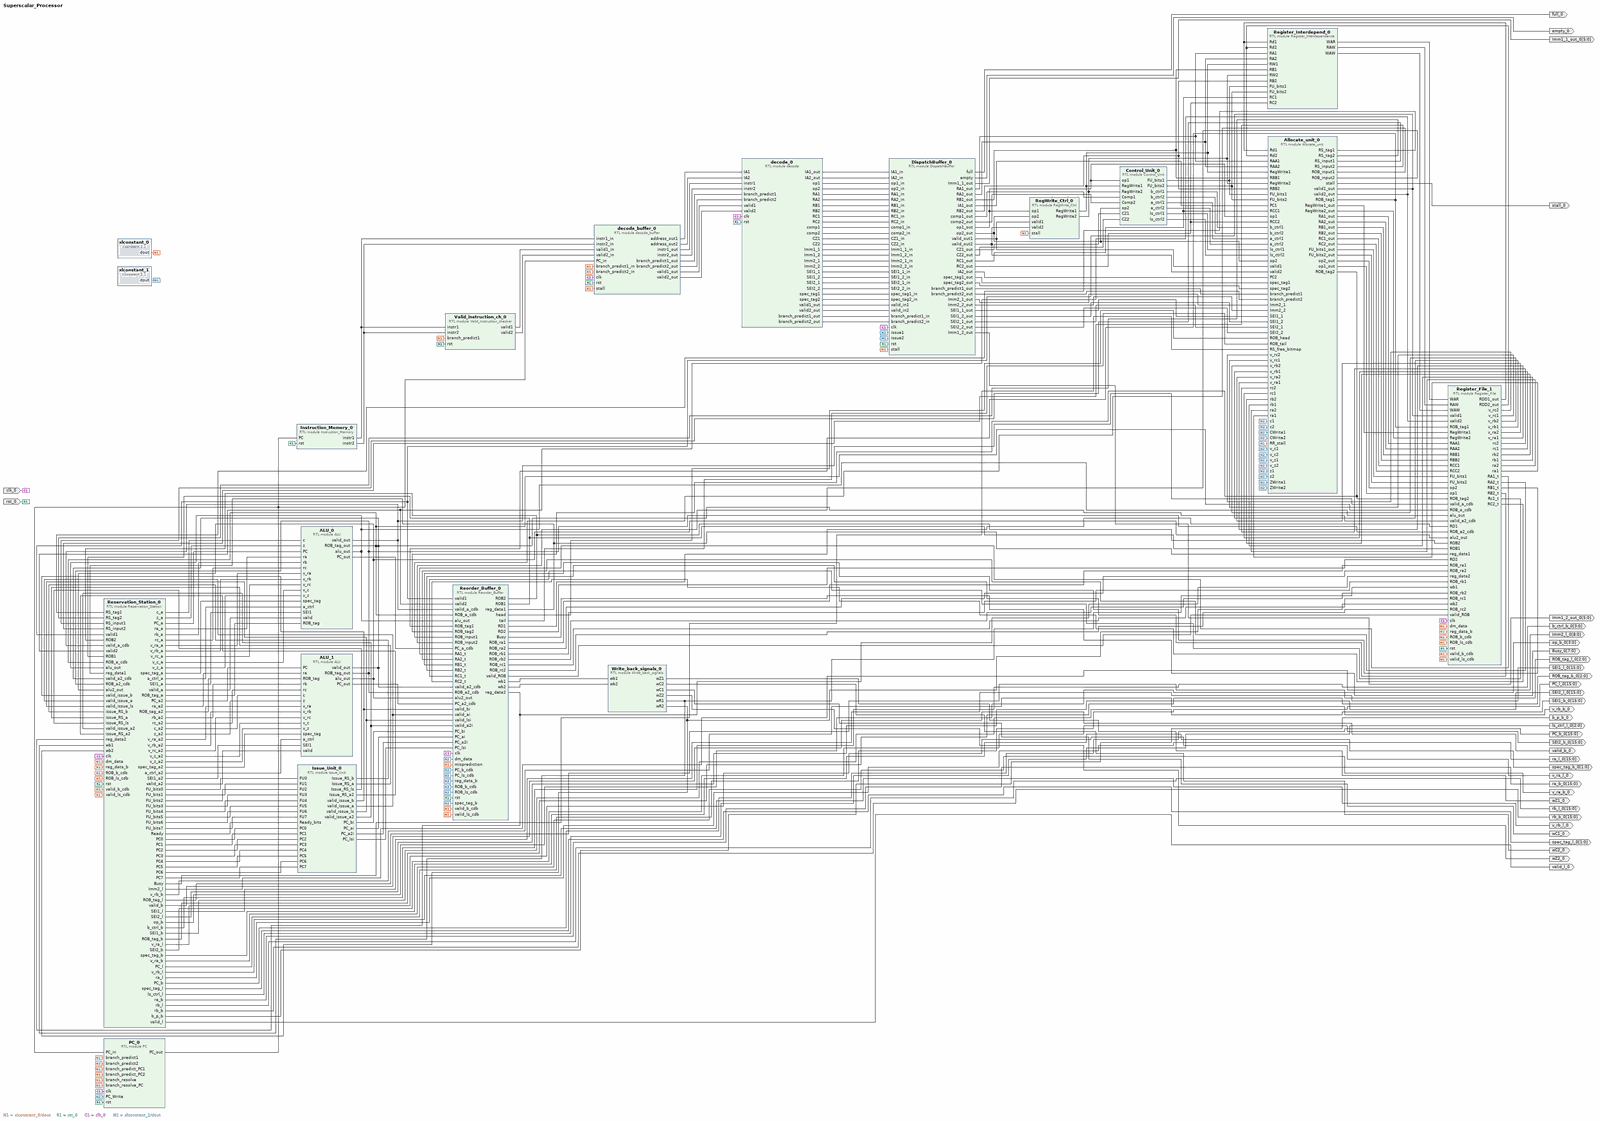
[diagram p0: block diagram of the top level, whole]
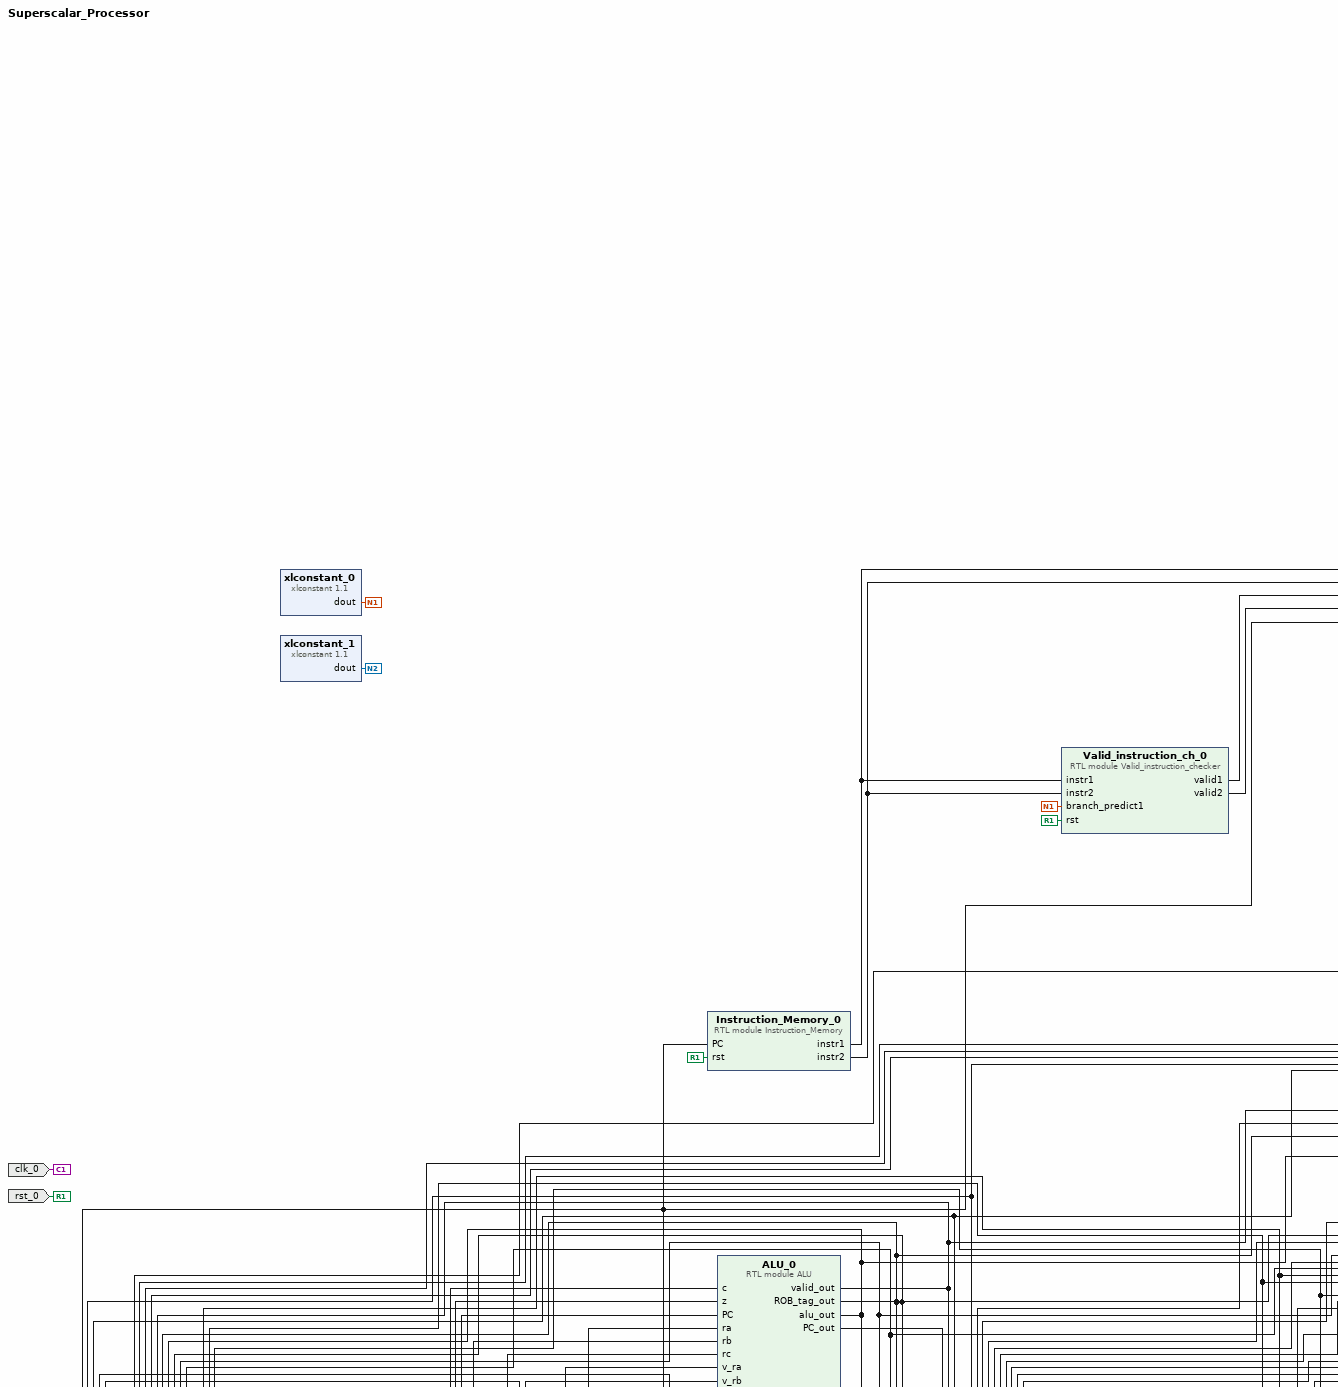
[diagram p1: block diagram of the top level, upper left part]
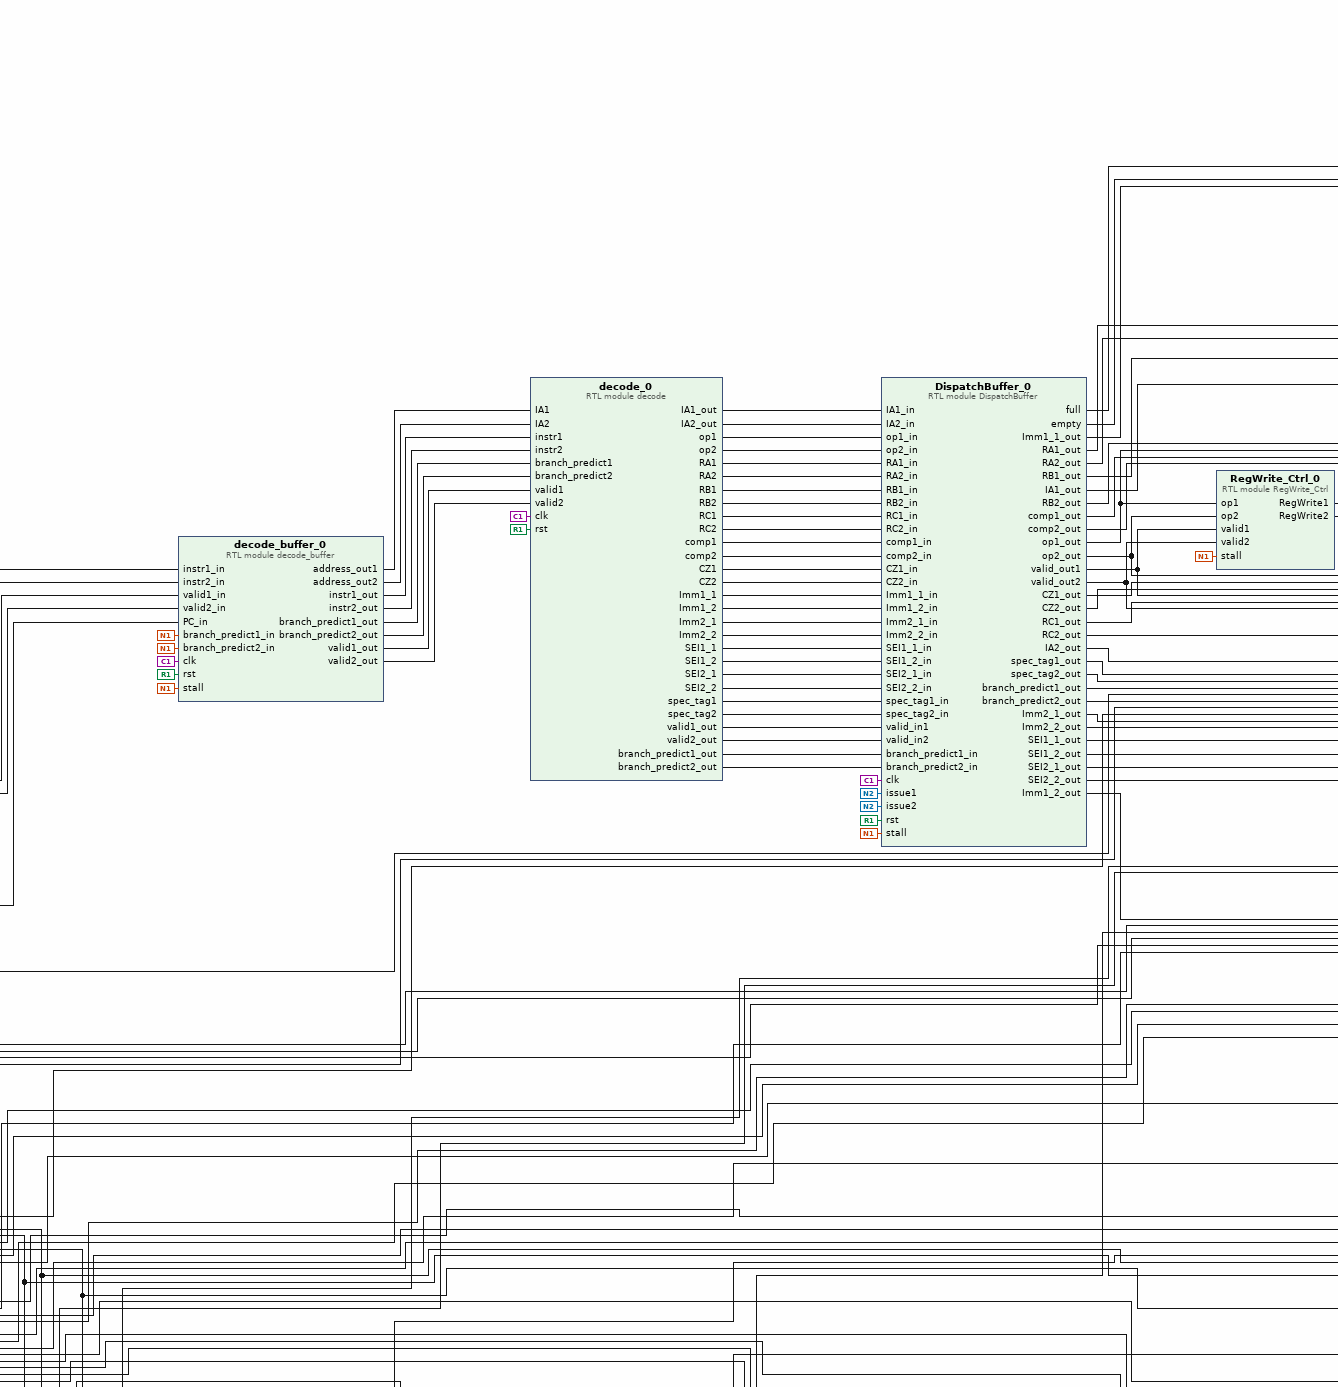
[diagram p2: block diagram of the top level, upper centre part]
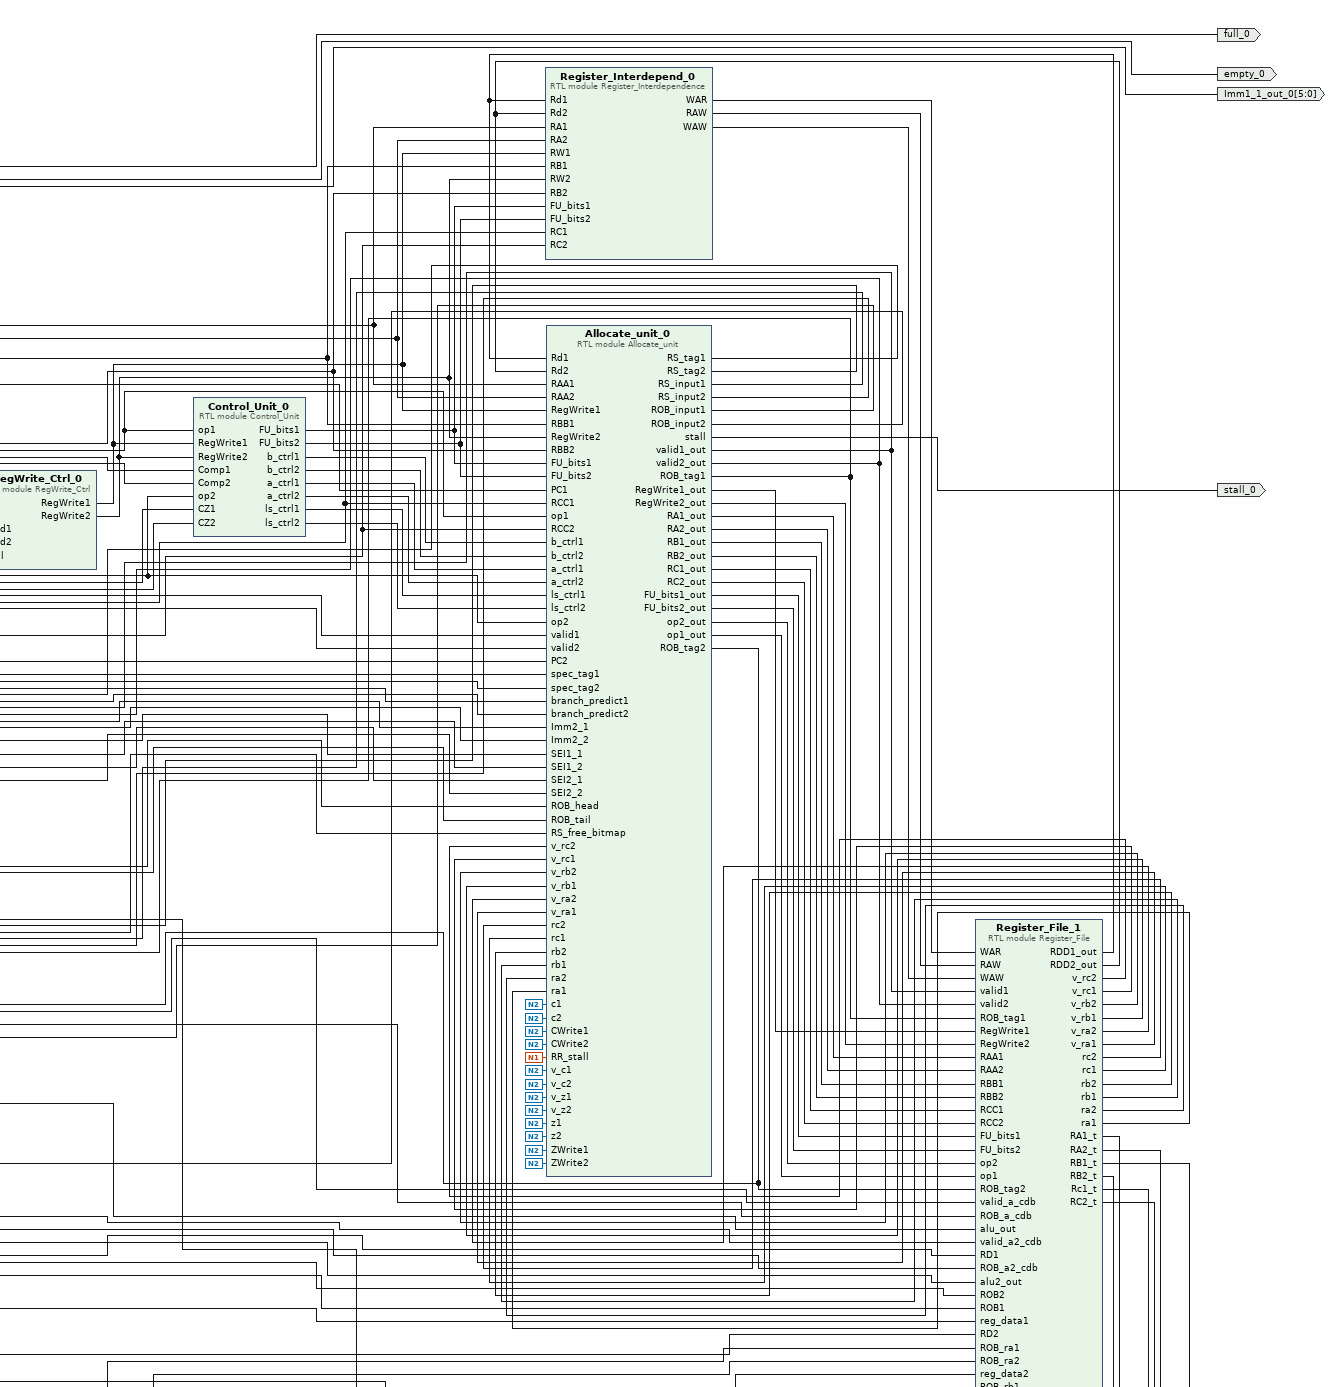
[diagram p3: block diagram of the top level, upper right part]
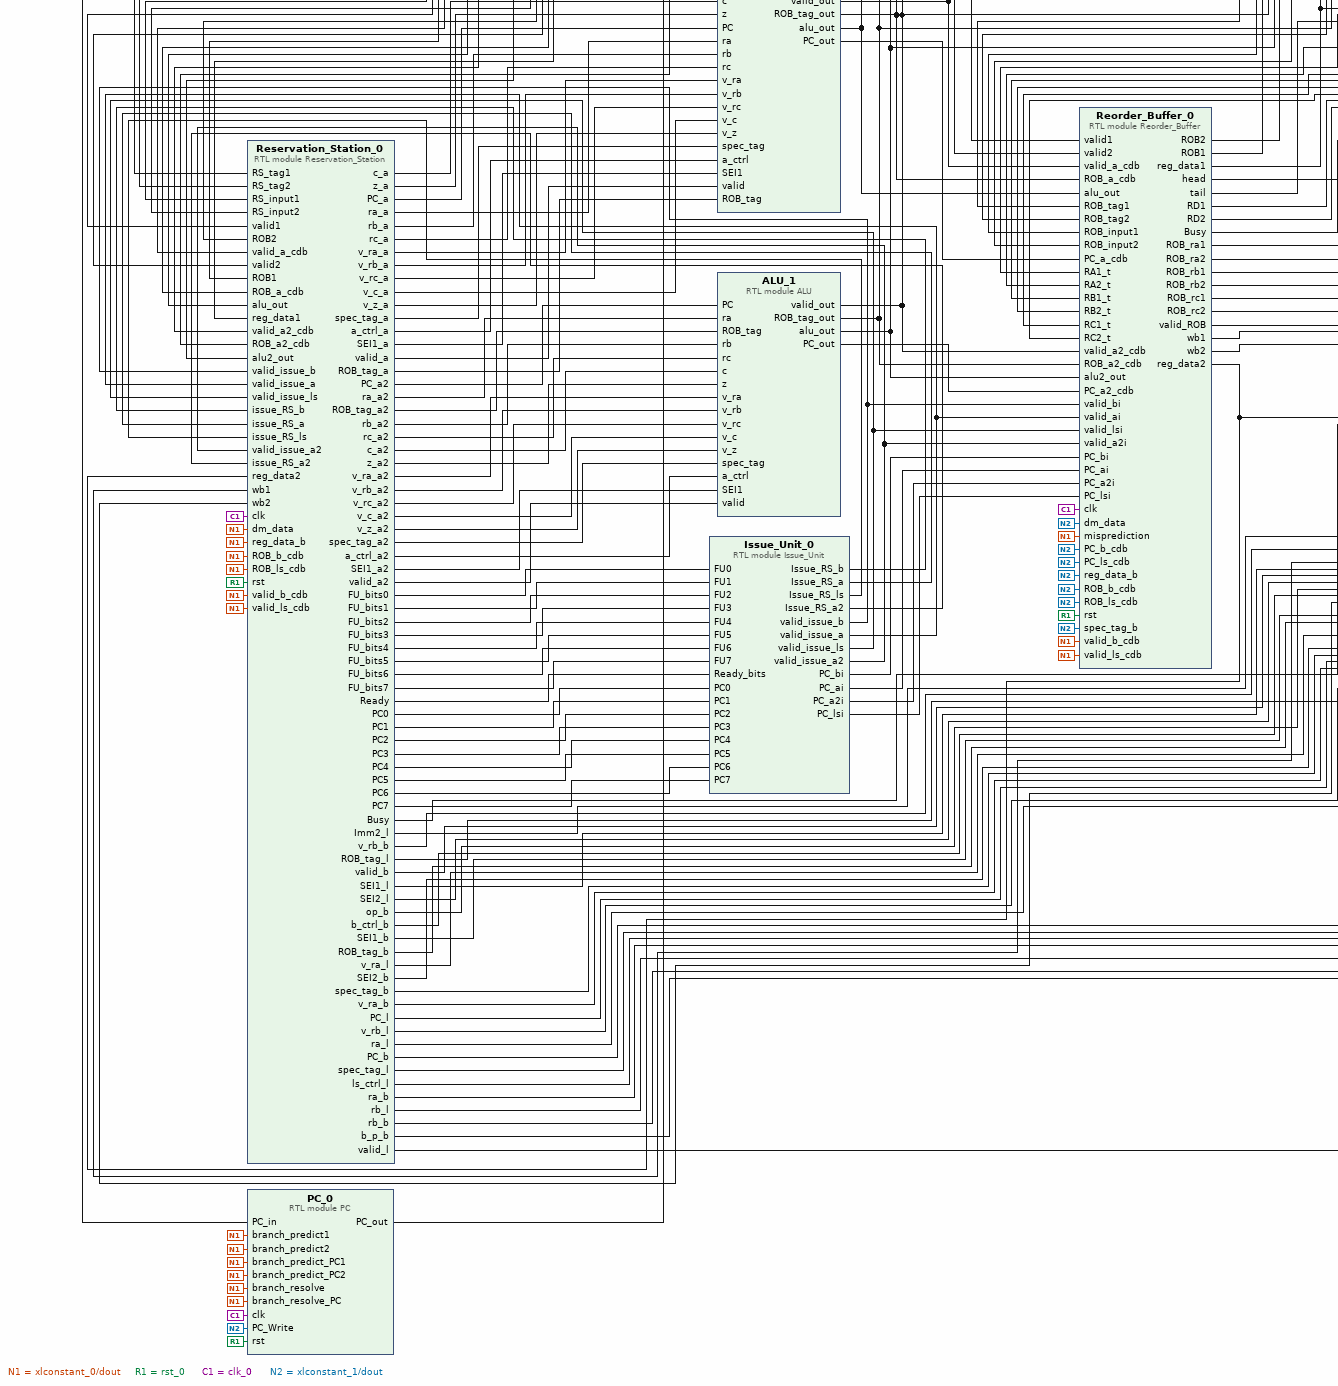
[diagram p4: block diagram of the top level, lower left part]
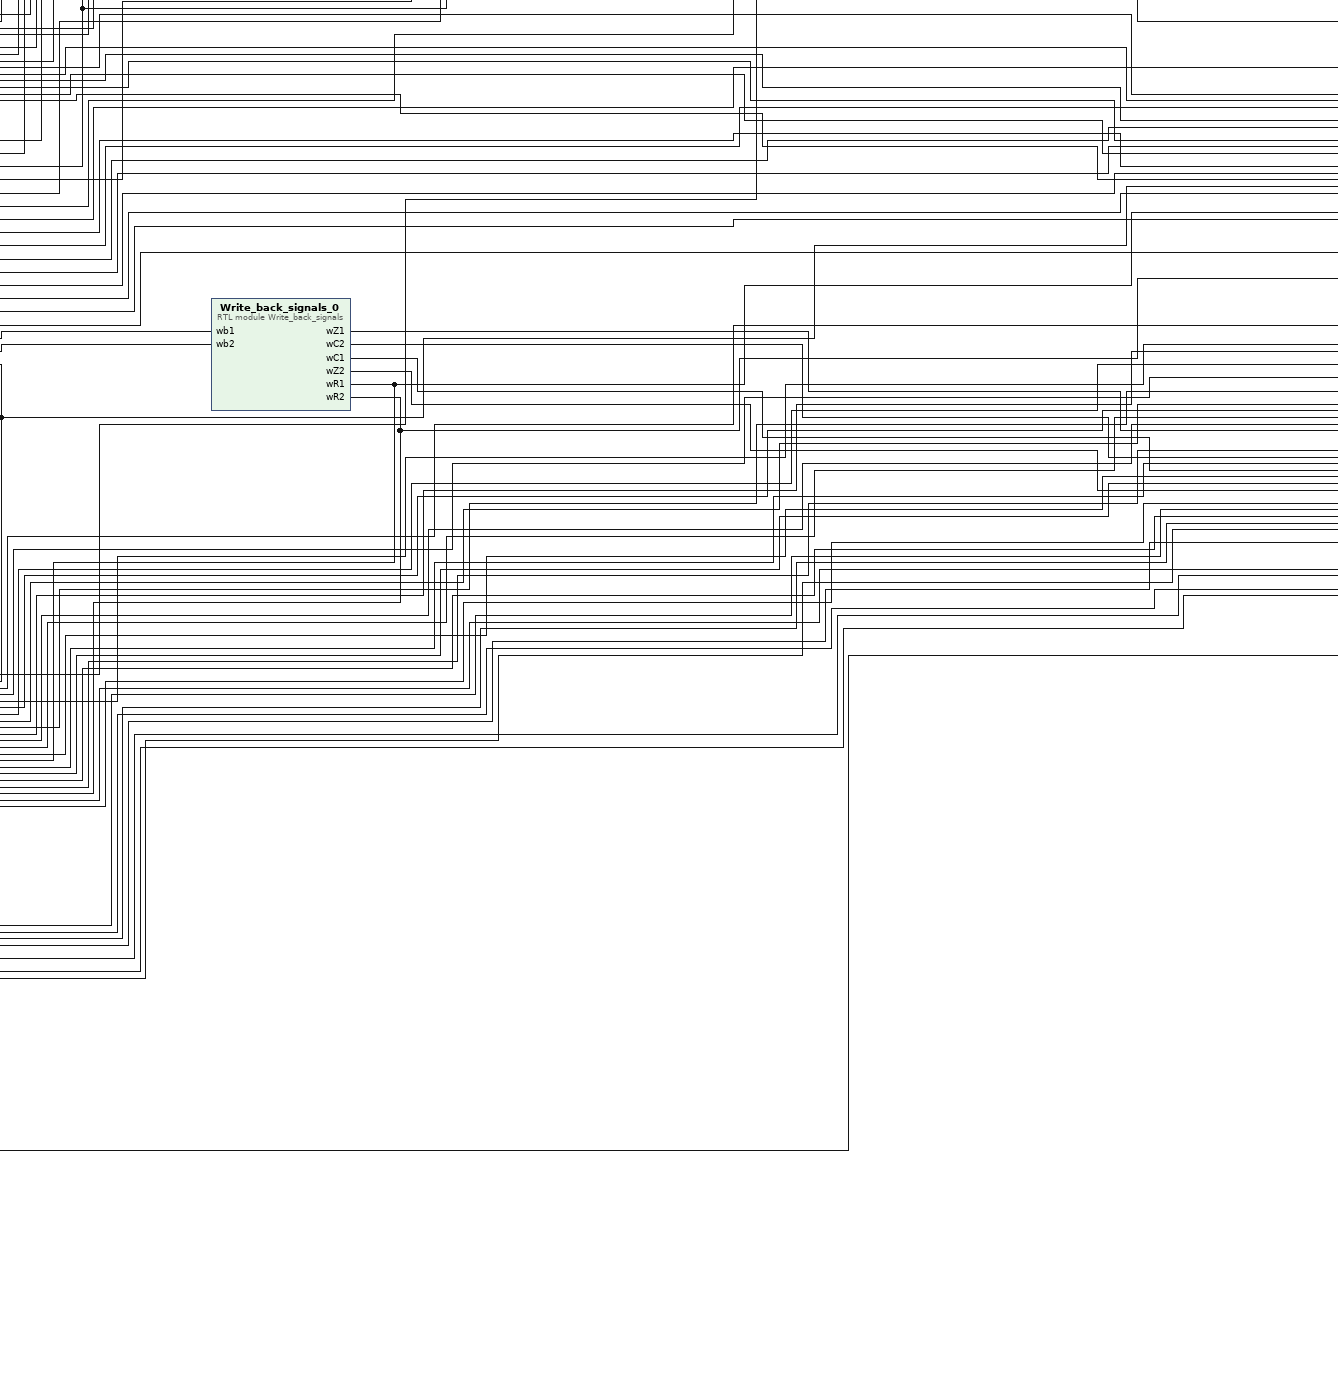
[diagram p5: block diagram of the top level, lower centre part]
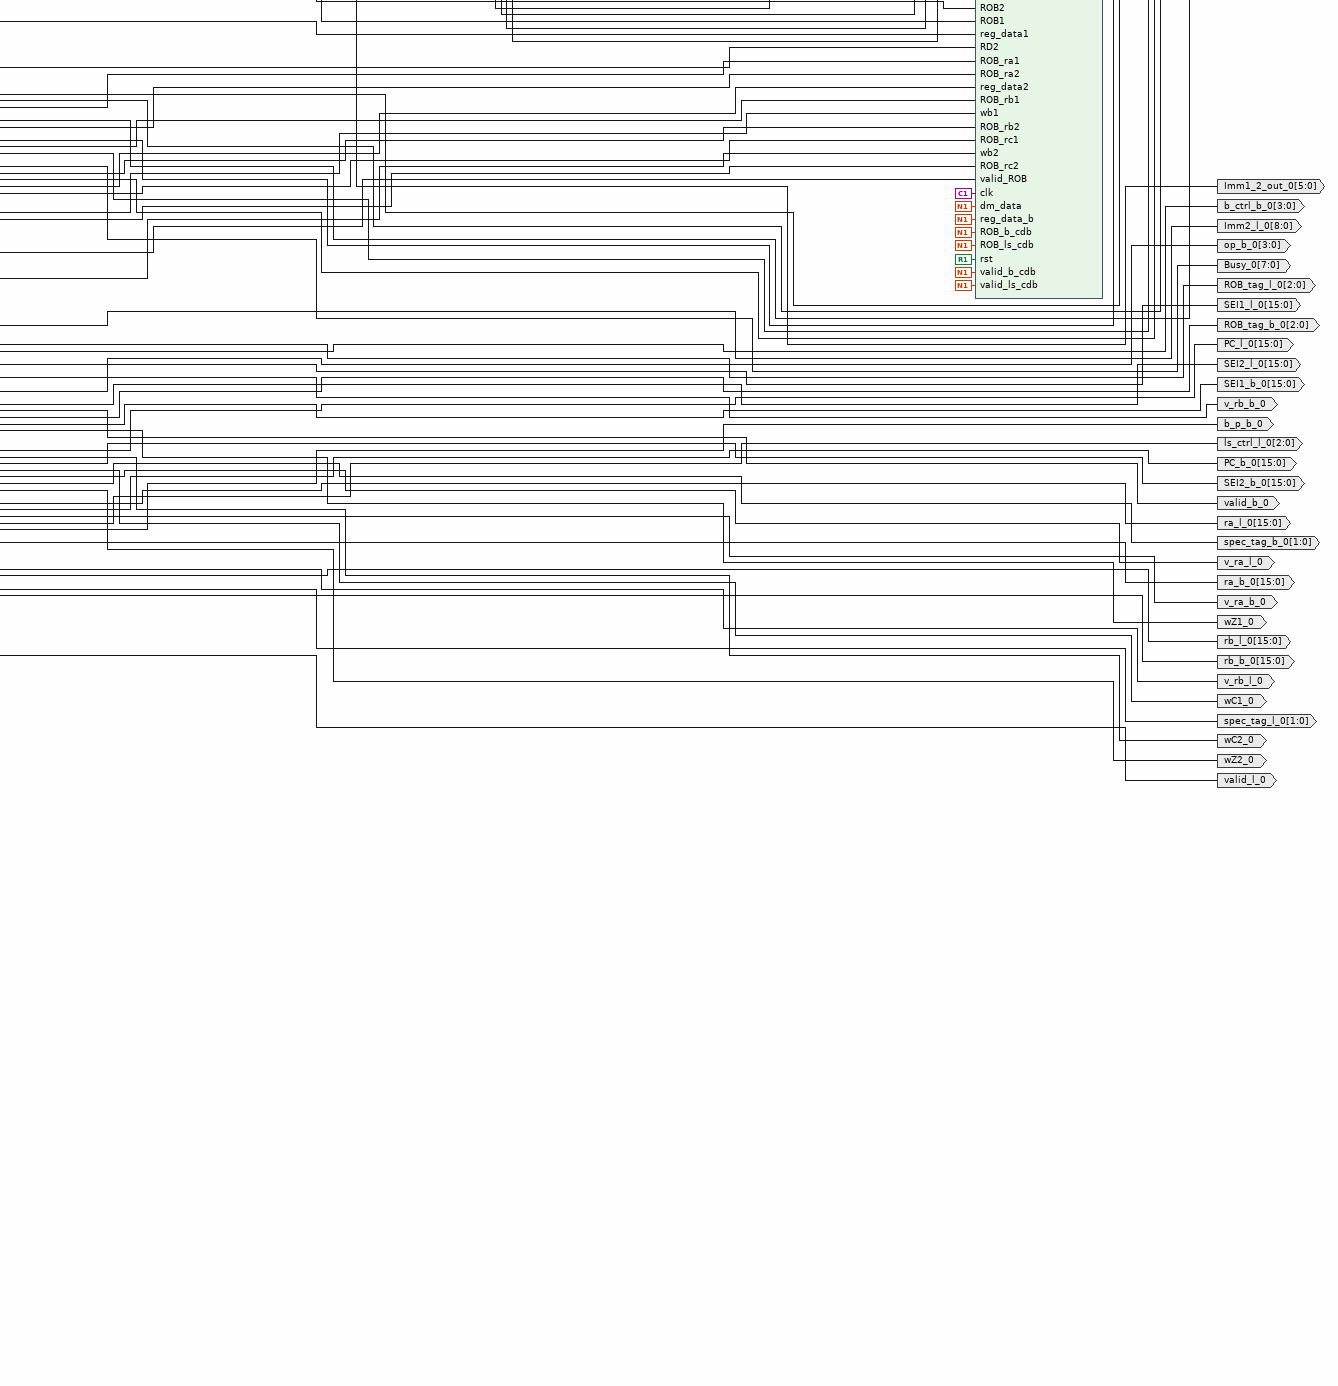
[diagram p6: block diagram of the top level, lower right part]
# Vivado block design Superscalar_Processor, xc7k70tfbv676-1, Vivado 2019.1
create_bd_design Superscalar_Processor

create_bd_port -dir I -type rst rst_0
create_bd_port -dir I -type clk clk_0
create_bd_port -dir O full_0
create_bd_port -dir O empty_0
create_bd_port -dir O -from 5 -to 0 Imm1_1_out_0
create_bd_port -dir O -from 5 -to 0 Imm1_2_out_0
create_bd_port -dir O stall_0
create_bd_port -dir O -from 8 -to 0 Imm2_l_0
create_bd_port -dir O v_rb_b_0
create_bd_port -dir O -from 2 -to 0 ROB_tag_l_0
create_bd_port -dir O valid_b_0
create_bd_port -dir O -from 15 -to 0 SEI1_l_0
create_bd_port -dir O -from 15 -to 0 SEI2_l_0
create_bd_port -dir O -from 3 -to 0 op_b_0
create_bd_port -dir O -from 3 -to 0 b_ctrl_b_0
create_bd_port -dir O -from 15 -to 0 SEI1_b_0
create_bd_port -dir O -from 2 -to 0 ROB_tag_b_0
create_bd_port -dir O v_ra_l_0
create_bd_port -dir O -from 15 -to 0 SEI2_b_0
create_bd_port -dir O -from 1 -to 0 spec_tag_b_0
create_bd_port -dir O v_ra_b_0
create_bd_port -dir O -from 15 -to 0 PC_l_0
create_bd_port -dir O v_rb_l_0
create_bd_port -dir O -from 15 -to 0 ra_l_0
create_bd_port -dir O -from 15 -to 0 PC_b_0
create_bd_port -dir O -from 1 -to 0 spec_tag_l_0
create_bd_port -dir O -from 2 -to 0 ls_ctrl_l_0
create_bd_port -dir O -from 15 -to 0 ra_b_0
create_bd_port -dir O -from 15 -to 0 rb_l_0
create_bd_port -dir O -from 15 -to 0 rb_b_0
create_bd_port -dir O b_p_b_0
create_bd_port -dir O valid_l_0
create_bd_port -dir O -from 7 -to 0 Busy_0
create_bd_port -dir O wZ1_0
create_bd_port -dir O wC2_0
create_bd_port -dir O wC1_0
create_bd_port -dir O wZ2_0

create_bd_cell -type ip -vlnv xilinx.com:ip:xlconstant:1.1 xlconstant_0
set_property -dict {CONFIG.CONST_VAL 0} [get_bd_cells xlconstant_0]
create_bd_cell -type ip -vlnv xilinx.com:ip:xlconstant:1.1 xlconstant_1
create_bd_cell -type module -reference PC PC_0
create_bd_cell -type module -reference RegWrite_Ctrl RegWrite_Ctrl_0
create_bd_cell -type module -reference Write_back_signals Write_back_signals_0
create_bd_cell -type module -reference decode decode_0
create_bd_cell -type module -reference Instruction_Memory Instruction_Memory_0
create_bd_cell -type module -reference Control_Unit Control_Unit_0
create_bd_cell -type module -reference Issue_Unit Issue_Unit_0
create_bd_cell -type module -reference Valid_instruction_checker Valid_instruction_ch_0
create_bd_cell -type module -reference decode_buffer decode_buffer_0
create_bd_cell -type module -reference DispatchBuffer DispatchBuffer_0
create_bd_cell -type module -reference ALU ALU_0
create_bd_cell -type module -reference ALU ALU_1
create_bd_cell -type module -reference Register_Interdependence Register_Interdepend_0
create_bd_cell -type module -reference Reservation_Station Reservation_Station_0
create_bd_cell -type module -reference Register_File Register_File_1
create_bd_cell -type module -reference Reorder_Buffer Reorder_Buffer_0
create_bd_cell -type module -reference Allocate_unit Allocate_unit_0

# ---- connections ----

connect_bd_net [get_bd_pins PC_0/PC_out] [get_bd_pins PC_0/PC_in] [get_bd_pins Instruction_Memory_0/PC] [get_bd_pins decode_buffer_0/PC_in]
connect_bd_net [get_bd_pins Instruction_Memory_0/instr1] [get_bd_pins Valid_instruction_ch_0/instr1] [get_bd_pins decode_buffer_0/instr1_in]
connect_bd_net [get_bd_pins Instruction_Memory_0/instr2] [get_bd_pins Valid_instruction_ch_0/instr2] [get_bd_pins decode_buffer_0/instr2_in]
connect_bd_net [get_bd_pins Valid_instruction_ch_0/valid1] [get_bd_pins decode_buffer_0/valid1_in]
connect_bd_net [get_bd_pins Valid_instruction_ch_0/valid2] [get_bd_pins decode_buffer_0/valid2_in]
connect_bd_net [get_bd_pins xlconstant_0/dout] \
  [get_bd_pins PC_0/branch_predict1] [get_bd_pins PC_0/branch_predict_PC1] [get_bd_pins PC_0/branch_predict2] \
  [get_bd_pins PC_0/branch_predict_PC2] [get_bd_pins PC_0/branch_resolve] [get_bd_pins PC_0/branch_resolve_PC] \
  [get_bd_pins RegWrite_Ctrl_0/stall] [get_bd_pins Valid_instruction_ch_0/branch_predict1] \
  [get_bd_pins decode_buffer_0/stall] [get_bd_pins decode_buffer_0/branch_predict1_in] \
  [get_bd_pins decode_buffer_0/branch_predict2_in] [get_bd_pins DispatchBuffer_0/stall] \
  [get_bd_pins Reservation_Station_0/valid_b_cdb] [get_bd_pins Reservation_Station_0/valid_ls_cdb] \
  [get_bd_pins Reservation_Station_0/reg_data_b] [get_bd_pins Reservation_Station_0/dm_data] \
  [get_bd_pins Reservation_Station_0/ROB_b_cdb] [get_bd_pins Reservation_Station_0/ROB_ls_cdb] \
  [get_bd_pins Register_File_1/valid_b_cdb] [get_bd_pins Register_File_1/valid_ls_cdb] \
  [get_bd_pins Register_File_1/reg_data_b] [get_bd_pins Register_File_1/dm_data] [get_bd_pins Register_File_1/ROB_b_cdb] \
  [get_bd_pins Register_File_1/ROB_ls_cdb] [get_bd_pins Reorder_Buffer_0/valid_b_cdb] \
  [get_bd_pins Reorder_Buffer_0/valid_ls_cdb] [get_bd_pins Reorder_Buffer_0/misprediction] \
  [get_bd_pins Allocate_unit_0/RR_stall]
connect_bd_net [get_bd_pins decode_buffer_0/address_out1] [get_bd_pins decode_0/IA1]
connect_bd_net [get_bd_pins decode_buffer_0/address_out2] [get_bd_pins decode_0/IA2]
connect_bd_net [get_bd_pins decode_buffer_0/instr1_out] [get_bd_pins decode_0/instr1]
connect_bd_net [get_bd_pins decode_buffer_0/instr2_out] [get_bd_pins decode_0/instr2]
connect_bd_net [get_bd_pins decode_buffer_0/branch_predict1_out] [get_bd_pins decode_0/branch_predict1]
connect_bd_net [get_bd_pins decode_buffer_0/branch_predict2_out] [get_bd_pins decode_0/branch_predict2]
connect_bd_net [get_bd_pins decode_buffer_0/valid1_out] [get_bd_pins decode_0/valid1]
connect_bd_net [get_bd_pins decode_buffer_0/valid2_out] [get_bd_pins decode_0/valid2]
connect_bd_net [get_bd_pins decode_0/IA1_out] [get_bd_pins DispatchBuffer_0/IA1_in]
connect_bd_net [get_bd_pins decode_0/IA2_out] [get_bd_pins DispatchBuffer_0/IA2_in]
connect_bd_net [get_bd_pins decode_0/op1] [get_bd_pins DispatchBuffer_0/op1_in]
connect_bd_net [get_bd_pins decode_0/op2] [get_bd_pins DispatchBuffer_0/op2_in]
connect_bd_net [get_bd_pins decode_0/RA1] [get_bd_pins DispatchBuffer_0/RA1_in]
connect_bd_net [get_bd_pins decode_0/RA2] [get_bd_pins DispatchBuffer_0/RA2_in]
connect_bd_net [get_bd_pins decode_0/RB1] [get_bd_pins DispatchBuffer_0/RB1_in]
connect_bd_net [get_bd_pins decode_0/RB2] [get_bd_pins DispatchBuffer_0/RB2_in]
connect_bd_net [get_bd_pins decode_0/RC1] [get_bd_pins DispatchBuffer_0/RC1_in]
connect_bd_net [get_bd_pins decode_0/RC2] [get_bd_pins DispatchBuffer_0/RC2_in]
connect_bd_net [get_bd_pins decode_0/comp1] [get_bd_pins DispatchBuffer_0/comp1_in]
connect_bd_net [get_bd_pins decode_0/comp2] [get_bd_pins DispatchBuffer_0/comp2_in]
connect_bd_net [get_bd_pins decode_0/CZ1] [get_bd_pins DispatchBuffer_0/CZ1_in]
connect_bd_net [get_bd_pins decode_0/CZ2] [get_bd_pins DispatchBuffer_0/CZ2_in]
connect_bd_net [get_bd_pins decode_0/Imm1_1] [get_bd_pins DispatchBuffer_0/Imm1_1_in]
connect_bd_net [get_bd_pins decode_0/Imm1_2] [get_bd_pins DispatchBuffer_0/Imm1_2_in]
connect_bd_net [get_bd_pins decode_0/Imm2_1] [get_bd_pins DispatchBuffer_0/Imm2_1_in]
connect_bd_net [get_bd_pins decode_0/Imm2_2] [get_bd_pins DispatchBuffer_0/Imm2_2_in]
connect_bd_net [get_bd_pins decode_0/SEI1_1] [get_bd_pins DispatchBuffer_0/SEI1_1_in]
connect_bd_net [get_bd_pins decode_0/SEI1_2] [get_bd_pins DispatchBuffer_0/SEI1_2_in]
connect_bd_net [get_bd_pins decode_0/SEI2_1] [get_bd_pins DispatchBuffer_0/SEI2_1_in]
connect_bd_net [get_bd_pins decode_0/SEI2_2] [get_bd_pins DispatchBuffer_0/SEI2_2_in]
connect_bd_net [get_bd_pins decode_0/spec_tag1] [get_bd_pins DispatchBuffer_0/spec_tag1_in]
connect_bd_net [get_bd_pins decode_0/spec_tag2] [get_bd_pins DispatchBuffer_0/spec_tag2_in]
connect_bd_net [get_bd_pins decode_0/valid1_out] [get_bd_pins DispatchBuffer_0/valid_in1]
connect_bd_net [get_bd_pins decode_0/valid2_out] [get_bd_pins DispatchBuffer_0/valid_in2]
connect_bd_net [get_bd_pins decode_0/branch_predict1_out] [get_bd_pins DispatchBuffer_0/branch_predict1_in]
connect_bd_net [get_bd_pins decode_0/branch_predict2_out] [get_bd_pins DispatchBuffer_0/branch_predict2_in]
connect_bd_net [get_bd_pins RegWrite_Ctrl_0/RegWrite1] \
  [get_bd_pins Control_Unit_0/RegWrite1] [get_bd_pins Register_Interdepend_0/RW1] [get_bd_pins Allocate_unit_0/RegWrite1]
connect_bd_net [get_bd_pins RegWrite_Ctrl_0/RegWrite2] \
  [get_bd_pins Control_Unit_0/RegWrite2] [get_bd_pins Register_Interdepend_0/RW2] [get_bd_pins Allocate_unit_0/RegWrite2]
connect_bd_net [get_bd_pins DispatchBuffer_0/IA1_out] [get_bd_pins Allocate_unit_0/PC1]
connect_bd_net [get_bd_pins DispatchBuffer_0/IA2_out] [get_bd_pins Allocate_unit_0/PC2]
connect_bd_net [get_bd_pins DispatchBuffer_0/op1_out] \
  [get_bd_pins RegWrite_Ctrl_0/op1] [get_bd_pins Control_Unit_0/op1] [get_bd_pins Allocate_unit_0/op1]
connect_bd_net [get_bd_pins DispatchBuffer_0/op2_out] \
  [get_bd_pins RegWrite_Ctrl_0/op2] [get_bd_pins Control_Unit_0/op2] [get_bd_pins Allocate_unit_0/op2]
connect_bd_net [get_bd_pins DispatchBuffer_0/comp1_out] [get_bd_pins Control_Unit_0/Comp1]
connect_bd_net [get_bd_pins DispatchBuffer_0/comp2_out] [get_bd_pins Control_Unit_0/Comp2]
connect_bd_net [get_bd_pins DispatchBuffer_0/CZ1_out] [get_bd_pins Control_Unit_0/CZ1]
connect_bd_net [get_bd_pins DispatchBuffer_0/CZ2_out] [get_bd_pins Control_Unit_0/CZ2]
connect_bd_net [get_bd_pins DispatchBuffer_0/valid_out1] [get_bd_pins RegWrite_Ctrl_0/valid1] [get_bd_pins Allocate_unit_0/valid1]
connect_bd_net [get_bd_pins DispatchBuffer_0/valid_out2] [get_bd_pins RegWrite_Ctrl_0/valid2] [get_bd_pins Allocate_unit_0/valid2]
connect_bd_net [get_bd_pins Control_Unit_0/b_ctrl1] [get_bd_pins Allocate_unit_0/b_ctrl1]
connect_bd_net [get_bd_pins Control_Unit_0/b_ctrl2] [get_bd_pins Allocate_unit_0/b_ctrl2]
connect_bd_net [get_bd_pins Control_Unit_0/a_ctrl1] [get_bd_pins Allocate_unit_0/a_ctrl1]
connect_bd_net [get_bd_pins Control_Unit_0/a_ctrl2] [get_bd_pins Allocate_unit_0/a_ctrl2]
connect_bd_net [get_bd_pins Control_Unit_0/ls_ctrl1] [get_bd_pins Allocate_unit_0/ls_ctrl1]
connect_bd_net [get_bd_pins Control_Unit_0/ls_ctrl2] [get_bd_pins Allocate_unit_0/ls_ctrl2]
connect_bd_net [get_bd_pins DispatchBuffer_0/spec_tag1_out] [get_bd_pins Allocate_unit_0/spec_tag1]
connect_bd_net [get_bd_pins DispatchBuffer_0/spec_tag2_out] [get_bd_pins Allocate_unit_0/spec_tag2]
connect_bd_net [get_bd_pins DispatchBuffer_0/branch_predict1_out] [get_bd_pins Allocate_unit_0/branch_predict1]
connect_bd_net [get_bd_pins DispatchBuffer_0/branch_predict2_out] [get_bd_pins Allocate_unit_0/branch_predict2]
connect_bd_net [get_bd_pins DispatchBuffer_0/Imm2_1_out] [get_bd_pins Allocate_unit_0/Imm2_1]
connect_bd_net [get_bd_pins DispatchBuffer_0/Imm2_2_out] [get_bd_pins Allocate_unit_0/Imm2_2]
connect_bd_net [get_bd_pins DispatchBuffer_0/SEI1_1_out] [get_bd_pins Allocate_unit_0/SEI1_1]
connect_bd_net [get_bd_pins DispatchBuffer_0/SEI1_2_out] [get_bd_pins Allocate_unit_0/SEI1_2]
connect_bd_net [get_bd_pins DispatchBuffer_0/SEI2_1_out] [get_bd_pins Allocate_unit_0/SEI2_1]
connect_bd_net [get_bd_pins DispatchBuffer_0/SEI2_2_out] [get_bd_pins Allocate_unit_0/SEI2_2]
connect_bd_net [get_bd_pins Register_Interdepend_0/WAR] [get_bd_pins Register_File_1/WAR]
connect_bd_net [get_bd_pins Register_Interdepend_0/RAW] [get_bd_pins Register_File_1/RAW]
connect_bd_net [get_bd_pins Register_Interdepend_0/WAW] [get_bd_pins Register_File_1/WAW]
connect_bd_net [get_bd_pins DispatchBuffer_0/RA1_out] [get_bd_pins Register_Interdepend_0/RA1] [get_bd_pins Allocate_unit_0/RAA1]
connect_bd_net [get_bd_pins DispatchBuffer_0/RA2_out] [get_bd_pins Register_Interdepend_0/RA2] [get_bd_pins Allocate_unit_0/RAA2]
connect_bd_net [get_bd_pins DispatchBuffer_0/RB1_out] [get_bd_pins Register_Interdepend_0/RB1] [get_bd_pins Allocate_unit_0/RBB1]
connect_bd_net [get_bd_pins DispatchBuffer_0/RB2_out] [get_bd_pins Register_Interdepend_0/RB2] [get_bd_pins Allocate_unit_0/RBB2]
connect_bd_net [get_bd_pins DispatchBuffer_0/RC1_out] [get_bd_pins Register_Interdepend_0/RC1] [get_bd_pins Allocate_unit_0/RCC1]
connect_bd_net [get_bd_pins DispatchBuffer_0/RC2_out] [get_bd_pins Register_Interdepend_0/RC2] [get_bd_pins Allocate_unit_0/RCC2]
connect_bd_net [get_bd_pins Control_Unit_0/FU_bits1] [get_bd_pins Register_Interdepend_0/FU_bits1] [get_bd_pins Allocate_unit_0/FU_bits1]
connect_bd_net [get_bd_pins Control_Unit_0/FU_bits2] [get_bd_pins Register_Interdepend_0/FU_bits2] [get_bd_pins Allocate_unit_0/FU_bits2]
connect_bd_net [get_bd_pins Reorder_Buffer_0/head] [get_bd_pins Allocate_unit_0/ROB_head]
connect_bd_net [get_bd_pins Reorder_Buffer_0/tail] [get_bd_pins Allocate_unit_0/ROB_tail]
connect_bd_net [get_bd_pins Reservation_Station_0/Busy] [get_bd_pins Allocate_unit_0/RS_free_bitmap]
connect_bd_net [get_bd_pins Allocate_unit_0/valid1_out] \
  [get_bd_pins Reservation_Station_0/valid1] [get_bd_pins Register_File_1/valid1] [get_bd_pins Reorder_Buffer_0/valid1]
connect_bd_net [get_bd_pins Allocate_unit_0/valid2_out] \
  [get_bd_pins Reservation_Station_0/valid2] [get_bd_pins Register_File_1/valid2] [get_bd_pins Reorder_Buffer_0/valid2]
connect_bd_net [get_bd_pins Allocate_unit_0/RegWrite1_out] [get_bd_pins Register_File_1/RegWrite1]
connect_bd_net [get_bd_pins Allocate_unit_0/RegWrite2_out] [get_bd_pins Register_File_1/RegWrite2]
connect_bd_net [get_bd_pins Allocate_unit_0/RA1_out] [get_bd_pins Register_File_1/RAA1]
connect_bd_net [get_bd_pins Allocate_unit_0/RA2_out] [get_bd_pins Register_File_1/RAA2]
connect_bd_net [get_bd_pins Allocate_unit_0/RB1_out] [get_bd_pins Register_File_1/RBB1]
connect_bd_net [get_bd_pins Allocate_unit_0/RB2_out] [get_bd_pins Register_File_1/RBB2]
connect_bd_net [get_bd_pins Allocate_unit_0/RC1_out] [get_bd_pins Register_File_1/RCC1]
connect_bd_net [get_bd_pins Allocate_unit_0/RC2_out] [get_bd_pins Register_File_1/RCC2]
connect_bd_net [get_bd_pins Allocate_unit_0/FU_bits1_out] [get_bd_pins Register_File_1/FU_bits1]
connect_bd_net [get_bd_pins Allocate_unit_0/FU_bits2_out] [get_bd_pins Register_File_1/FU_bits2]
connect_bd_net [get_bd_pins Allocate_unit_0/ROB_tag1] [get_bd_pins Register_File_1/ROB_tag1] [get_bd_pins Reorder_Buffer_0/ROB_tag1]
connect_bd_net [get_bd_pins Allocate_unit_0/ROB_tag2] [get_bd_pins Register_File_1/ROB_tag2] [get_bd_pins Reorder_Buffer_0/ROB_tag2]
connect_bd_net [get_bd_pins Issue_Unit_0/valid_issue_b] [get_bd_pins Reservation_Station_0/valid_issue_b] [get_bd_pins Reorder_Buffer_0/valid_bi]
connect_bd_net [get_bd_pins Issue_Unit_0/valid_issue_a] [get_bd_pins Reservation_Station_0/valid_issue_a] [get_bd_pins Reorder_Buffer_0/valid_ai]
connect_bd_net [get_bd_pins Issue_Unit_0/valid_issue_ls] [get_bd_pins Reservation_Station_0/valid_issue_ls] [get_bd_pins Reorder_Buffer_0/valid_lsi]
connect_bd_net [get_bd_pins Issue_Unit_0/Issue_RS_b] [get_bd_pins Reservation_Station_0/issue_RS_b]
connect_bd_net [get_bd_pins Issue_Unit_0/Issue_RS_a] [get_bd_pins Reservation_Station_0/issue_RS_a]
connect_bd_net [get_bd_pins Issue_Unit_0/Issue_RS_ls] [get_bd_pins Reservation_Station_0/issue_RS_ls]
connect_bd_net [get_bd_pins Allocate_unit_0/RS_tag1] [get_bd_pins Reservation_Station_0/RS_tag1]
connect_bd_net [get_bd_pins Allocate_unit_0/RS_tag2] [get_bd_pins Reservation_Station_0/RS_tag2]
connect_bd_net [get_bd_pins Allocate_unit_0/RS_input1] [get_bd_pins Reservation_Station_0/RS_input1]
connect_bd_net [get_bd_pins Allocate_unit_0/RS_input2] [get_bd_pins Reservation_Station_0/RS_input2]
connect_bd_net [get_bd_pins ALU_0/valid_out] \
  [get_bd_pins Reservation_Station_0/valid_a_cdb] [get_bd_pins Register_File_1/valid_a_cdb] \
  [get_bd_pins Reorder_Buffer_0/valid_a_cdb]
connect_bd_net [get_bd_pins ALU_0/ROB_tag_out] \
  [get_bd_pins Reservation_Station_0/ROB_a_cdb] [get_bd_pins Register_File_1/ROB_a_cdb] \
  [get_bd_pins Reorder_Buffer_0/ROB_a_cdb]
connect_bd_net [get_bd_pins ALU_0/alu_out] \
  [get_bd_pins Reservation_Station_0/alu_out] [get_bd_pins Register_File_1/alu_out] [get_bd_pins Reorder_Buffer_0/alu_out]
connect_bd_net [get_bd_pins Reservation_Station_0/c_a] [get_bd_pins ALU_0/c]
connect_bd_net [get_bd_pins Reservation_Station_0/z_a] [get_bd_pins ALU_0/z]
connect_bd_net [get_bd_pins Reservation_Station_0/PC_a] [get_bd_pins ALU_0/PC]
connect_bd_net [get_bd_pins Reservation_Station_0/ra_a] [get_bd_pins ALU_0/ra]
connect_bd_net [get_bd_pins Reservation_Station_0/rb_a] [get_bd_pins ALU_0/rb]
connect_bd_net [get_bd_pins Reservation_Station_0/rc_a] [get_bd_pins ALU_0/rc]
connect_bd_net [get_bd_pins Reservation_Station_0/v_ra_a] [get_bd_pins ALU_0/v_ra]
connect_bd_net [get_bd_pins Reservation_Station_0/v_rb_a] [get_bd_pins ALU_0/v_rb]
connect_bd_net [get_bd_pins Reservation_Station_0/v_rc_a] [get_bd_pins ALU_0/v_rc]
connect_bd_net [get_bd_pins Reservation_Station_0/v_c_a] [get_bd_pins ALU_0/v_c]
connect_bd_net [get_bd_pins Reservation_Station_0/v_z_a] [get_bd_pins ALU_0/v_z]
connect_bd_net [get_bd_pins Reservation_Station_0/spec_tag_a] [get_bd_pins ALU_0/spec_tag]
connect_bd_net [get_bd_pins Reservation_Station_0/a_ctrl_a] [get_bd_pins ALU_0/a_ctrl]
connect_bd_net [get_bd_pins Reservation_Station_0/SEI1_a] [get_bd_pins ALU_0/SEI1]
connect_bd_net [get_bd_pins Reservation_Station_0/valid_a] [get_bd_pins ALU_0/valid]
connect_bd_net [get_bd_pins Reservation_Station_0/ROB_tag_a] [get_bd_pins ALU_0/ROB_tag]
connect_bd_net [get_bd_pins Reservation_Station_0/FU_bits0] [get_bd_pins Issue_Unit_0/FU0]
connect_bd_net [get_bd_pins Reservation_Station_0/FU_bits1] [get_bd_pins Issue_Unit_0/FU1]
connect_bd_net [get_bd_pins Reservation_Station_0/FU_bits2] [get_bd_pins Issue_Unit_0/FU2]
connect_bd_net [get_bd_pins Reservation_Station_0/FU_bits3] [get_bd_pins Issue_Unit_0/FU3]
connect_bd_net [get_bd_pins Reservation_Station_0/FU_bits4] [get_bd_pins Issue_Unit_0/FU4]
connect_bd_net [get_bd_pins Reservation_Station_0/FU_bits5] [get_bd_pins Issue_Unit_0/FU5]
connect_bd_net [get_bd_pins Reservation_Station_0/FU_bits6] [get_bd_pins Issue_Unit_0/FU6]
connect_bd_net [get_bd_pins Reservation_Station_0/FU_bits7] [get_bd_pins Issue_Unit_0/FU7]
connect_bd_net [get_bd_pins Reservation_Station_0/Ready] [get_bd_pins Issue_Unit_0/Ready_bits]
connect_bd_net [get_bd_pins Allocate_unit_0/ROB_input1] [get_bd_pins Reorder_Buffer_0/ROB_input1]
connect_bd_net [get_bd_pins Allocate_unit_0/ROB_input2] [get_bd_pins Reorder_Buffer_0/ROB_input2]
connect_bd_net [get_bd_pins ALU_0/PC_out] [get_bd_pins Reorder_Buffer_0/PC_a_cdb]
connect_bd_net [get_bd_pins Reorder_Buffer_0/wb1] [get_bd_pins Write_back_signals_0/wb1]
connect_bd_net [get_bd_pins Reorder_Buffer_0/wb2] [get_bd_pins Write_back_signals_0/wb2]
connect_bd_net [get_bd_pins Reorder_Buffer_0/RD1] [get_bd_pins Register_File_1/RD1]
connect_bd_net [get_bd_pins Reservation_Station_0/PC_a2] [get_bd_pins ALU_1/PC]
connect_bd_net [get_bd_pins Reservation_Station_0/ra_a2] [get_bd_pins ALU_1/ra]
connect_bd_net [get_bd_pins Reservation_Station_0/ROB_tag_a2] [get_bd_pins ALU_1/ROB_tag]
connect_bd_net [get_bd_pins Reservation_Station_0/rb_a2] [get_bd_pins ALU_1/rb]
connect_bd_net [get_bd_pins Reservation_Station_0/rc_a2] [get_bd_pins ALU_1/rc]
connect_bd_net [get_bd_pins Reservation_Station_0/c_a2] [get_bd_pins ALU_1/c]
connect_bd_net [get_bd_pins Reservation_Station_0/z_a2] [get_bd_pins ALU_1/z]
connect_bd_net [get_bd_pins Reservation_Station_0/v_ra_a2] [get_bd_pins ALU_1/v_ra]
connect_bd_net [get_bd_pins Reservation_Station_0/v_rb_a2] [get_bd_pins ALU_1/v_rb]
connect_bd_net [get_bd_pins Reservation_Station_0/v_rc_a2] [get_bd_pins ALU_1/v_rc]
connect_bd_net [get_bd_pins Reservation_Station_0/v_c_a2] [get_bd_pins ALU_1/v_c]
connect_bd_net [get_bd_pins Reservation_Station_0/v_z_a2] [get_bd_pins ALU_1/v_z]
connect_bd_net [get_bd_pins Reservation_Station_0/spec_tag_a2] [get_bd_pins ALU_1/spec_tag]
connect_bd_net [get_bd_pins Reservation_Station_0/a_ctrl_a2] [get_bd_pins ALU_1/a_ctrl]
connect_bd_net [get_bd_pins Reservation_Station_0/SEI1_a2] [get_bd_pins ALU_1/SEI1]
connect_bd_net [get_bd_pins Reservation_Station_0/valid_a2] [get_bd_pins ALU_1/valid]
connect_bd_net [get_bd_pins ALU_1/valid_out] \
  [get_bd_pins Reservation_Station_0/valid_a2_cdb] [get_bd_pins Register_File_1/valid_a2_cdb] \
  [get_bd_pins Reorder_Buffer_0/valid_a2_cdb]
connect_bd_net [get_bd_pins ALU_1/ROB_tag_out] \
  [get_bd_pins Reservation_Station_0/ROB_a2_cdb] [get_bd_pins Register_File_1/ROB_a2_cdb] \
  [get_bd_pins Reorder_Buffer_0/ROB_a2_cdb]
connect_bd_net [get_bd_pins ALU_1/alu_out] \
  [get_bd_pins Reservation_Station_0/alu2_out] [get_bd_pins Register_File_1/alu2_out] [get_bd_pins Reorder_Buffer_0/alu2_out]
connect_bd_net [get_bd_pins ALU_1/PC_out] [get_bd_pins Reorder_Buffer_0/PC_a2_cdb]
connect_bd_net [get_bd_pins Issue_Unit_0/PC_bi] [get_bd_pins Reorder_Buffer_0/PC_bi]
connect_bd_net [get_bd_pins Issue_Unit_0/PC_ai] [get_bd_pins Reorder_Buffer_0/PC_ai]
connect_bd_net [get_bd_pins Issue_Unit_0/PC_a2i] [get_bd_pins Reorder_Buffer_0/PC_a2i]
connect_bd_net [get_bd_pins Issue_Unit_0/PC_lsi] [get_bd_pins Reorder_Buffer_0/PC_lsi]
connect_bd_net [get_bd_pins Issue_Unit_0/Issue_RS_a2] [get_bd_pins Reservation_Station_0/issue_RS_a2]
connect_bd_net [get_bd_pins Issue_Unit_0/valid_issue_a2] [get_bd_pins Reservation_Station_0/valid_issue_a2] [get_bd_pins Reorder_Buffer_0/valid_a2i]
connect_bd_net -net rst_0_1 [get_bd_ports rst_0] \
  [get_bd_pins PC_0/rst] [get_bd_pins decode_0/rst] [get_bd_pins Instruction_Memory_0/rst] \
  [get_bd_pins Valid_instruction_ch_0/rst] [get_bd_pins decode_buffer_0/rst] [get_bd_pins DispatchBuffer_0/rst] \
  [get_bd_pins Reservation_Station_0/rst] [get_bd_pins Register_File_1/rst] [get_bd_pins Reorder_Buffer_0/rst]
connect_bd_net -net clk_0_1 [get_bd_ports clk_0] \
  [get_bd_pins PC_0/clk] [get_bd_pins decode_0/clk] [get_bd_pins decode_buffer_0/clk] [get_bd_pins DispatchBuffer_0/clk] \
  [get_bd_pins Reservation_Station_0/clk] [get_bd_pins Register_File_1/clk] [get_bd_pins Reorder_Buffer_0/clk]
connect_bd_net [get_bd_pins xlconstant_1/dout] \
  [get_bd_pins PC_0/PC_Write] [get_bd_pins DispatchBuffer_0/issue1] [get_bd_pins DispatchBuffer_0/issue2] \
  [get_bd_pins Reorder_Buffer_0/spec_tag_b] [get_bd_pins Reorder_Buffer_0/PC_b_cdb] [get_bd_pins Reorder_Buffer_0/PC_ls_cdb] \
  [get_bd_pins Reorder_Buffer_0/reg_data_b] [get_bd_pins Reorder_Buffer_0/dm_data] [get_bd_pins Reorder_Buffer_0/ROB_b_cdb] \
  [get_bd_pins Reorder_Buffer_0/ROB_ls_cdb] [get_bd_pins Allocate_unit_0/CWrite1] [get_bd_pins Allocate_unit_0/ZWrite1] \
  [get_bd_pins Allocate_unit_0/CWrite2] [get_bd_pins Allocate_unit_0/ZWrite2] [get_bd_pins Allocate_unit_0/c1] \
  [get_bd_pins Allocate_unit_0/c2] [get_bd_pins Allocate_unit_0/z1] [get_bd_pins Allocate_unit_0/z2] \
  [get_bd_pins Allocate_unit_0/v_c1] [get_bd_pins Allocate_unit_0/v_c2] [get_bd_pins Allocate_unit_0/v_z1] \
  [get_bd_pins Allocate_unit_0/v_z2]
connect_bd_net [get_bd_pins DispatchBuffer_0/full] [get_bd_ports full_0]
connect_bd_net [get_bd_pins DispatchBuffer_0/empty] [get_bd_ports empty_0]
connect_bd_net [get_bd_pins DispatchBuffer_0/Imm1_1_out] [get_bd_ports Imm1_1_out_0]
connect_bd_net [get_bd_pins DispatchBuffer_0/Imm1_2_out] [get_bd_ports Imm1_2_out_0]
connect_bd_net [get_bd_pins Allocate_unit_0/stall] [get_bd_ports stall_0]
connect_bd_net [get_bd_pins Reservation_Station_0/PC0] [get_bd_pins Issue_Unit_0/PC0]
connect_bd_net [get_bd_pins Reservation_Station_0/PC1] [get_bd_pins Issue_Unit_0/PC1]
connect_bd_net [get_bd_pins Reservation_Station_0/PC2] [get_bd_pins Issue_Unit_0/PC2]
connect_bd_net [get_bd_pins Reservation_Station_0/PC3] [get_bd_pins Issue_Unit_0/PC3]
connect_bd_net [get_bd_pins Reservation_Station_0/PC4] [get_bd_pins Issue_Unit_0/PC4]
connect_bd_net [get_bd_pins Reservation_Station_0/PC5] [get_bd_pins Issue_Unit_0/PC5]
connect_bd_net [get_bd_pins Reservation_Station_0/PC6] [get_bd_pins Issue_Unit_0/PC6]
connect_bd_net [get_bd_pins Reservation_Station_0/PC7] [get_bd_pins Issue_Unit_0/PC7]
connect_bd_net [get_bd_pins Reservation_Station_0/Imm2_l] [get_bd_ports Imm2_l_0]
connect_bd_net [get_bd_pins Reservation_Station_0/v_rb_b] [get_bd_ports v_rb_b_0]
connect_bd_net [get_bd_pins Reservation_Station_0/ROB_tag_l] [get_bd_ports ROB_tag_l_0]
connect_bd_net [get_bd_pins Reservation_Station_0/valid_b] [get_bd_ports valid_b_0]
connect_bd_net [get_bd_pins Reservation_Station_0/SEI1_l] [get_bd_ports SEI1_l_0]
connect_bd_net [get_bd_pins Reservation_Station_0/SEI2_l] [get_bd_ports SEI2_l_0]
connect_bd_net [get_bd_pins Reservation_Station_0/op_b] [get_bd_ports op_b_0]
connect_bd_net [get_bd_pins Reservation_Station_0/b_ctrl_b] [get_bd_ports b_ctrl_b_0]
connect_bd_net [get_bd_pins Reservation_Station_0/SEI1_b] [get_bd_ports SEI1_b_0]
connect_bd_net [get_bd_pins Reservation_Station_0/ROB_tag_b] [get_bd_ports ROB_tag_b_0]
connect_bd_net [get_bd_pins Reservation_Station_0/v_ra_l] [get_bd_ports v_ra_l_0]
connect_bd_net [get_bd_pins Reservation_Station_0/SEI2_b] [get_bd_ports SEI2_b_0]
connect_bd_net [get_bd_pins Reservation_Station_0/spec_tag_b] [get_bd_ports spec_tag_b_0]
connect_bd_net [get_bd_pins Reservation_Station_0/v_ra_b] [get_bd_ports v_ra_b_0]
connect_bd_net [get_bd_pins Reservation_Station_0/PC_l] [get_bd_ports PC_l_0]
connect_bd_net [get_bd_pins Reservation_Station_0/v_rb_l] [get_bd_ports v_rb_l_0]
connect_bd_net [get_bd_pins Reservation_Station_0/ra_l] [get_bd_ports ra_l_0]
connect_bd_net [get_bd_pins Reservation_Station_0/PC_b] [get_bd_ports PC_b_0]
connect_bd_net [get_bd_pins Reservation_Station_0/spec_tag_l] [get_bd_ports spec_tag_l_0]
connect_bd_net [get_bd_pins Reservation_Station_0/ls_ctrl_l] [get_bd_ports ls_ctrl_l_0]
connect_bd_net [get_bd_pins Reservation_Station_0/ra_b] [get_bd_ports ra_b_0]
connect_bd_net [get_bd_pins Reservation_Station_0/rb_l] [get_bd_ports rb_l_0]
connect_bd_net [get_bd_pins Reservation_Station_0/rb_b] [get_bd_ports rb_b_0]
connect_bd_net [get_bd_pins Reservation_Station_0/b_p_b] [get_bd_ports b_p_b_0]
connect_bd_net [get_bd_pins Reservation_Station_0/valid_l] [get_bd_ports valid_l_0]
connect_bd_net [get_bd_pins Reorder_Buffer_0/Busy] [get_bd_ports Busy_0]
connect_bd_net [get_bd_pins Write_back_signals_0/wZ1] [get_bd_ports wZ1_0]
connect_bd_net [get_bd_pins Write_back_signals_0/wC2] [get_bd_ports wC2_0]
connect_bd_net [get_bd_pins Write_back_signals_0/wC1] [get_bd_ports wC1_0]
connect_bd_net [get_bd_pins Write_back_signals_0/wZ2] [get_bd_ports wZ2_0]
connect_bd_net [get_bd_pins Allocate_unit_0/op2_out] [get_bd_pins Register_File_1/op2]
connect_bd_net [get_bd_pins Allocate_unit_0/op1_out] [get_bd_pins Register_File_1/op1]
connect_bd_net [get_bd_pins Register_File_1/v_rc2] [get_bd_pins Allocate_unit_0/v_rc2]
connect_bd_net [get_bd_pins Register_File_1/v_rc1] [get_bd_pins Allocate_unit_0/v_rc1]
connect_bd_net [get_bd_pins Register_File_1/v_rb2] [get_bd_pins Allocate_unit_0/v_rb2]
connect_bd_net [get_bd_pins Register_File_1/v_rb1] [get_bd_pins Allocate_unit_0/v_rb1]
connect_bd_net [get_bd_pins Register_File_1/v_ra2] [get_bd_pins Allocate_unit_0/v_ra2]
connect_bd_net [get_bd_pins Register_File_1/v_ra1] [get_bd_pins Allocate_unit_0/v_ra1]
connect_bd_net [get_bd_pins Register_File_1/rc2] [get_bd_pins Allocate_unit_0/rc2]
connect_bd_net [get_bd_pins Register_File_1/rc1] [get_bd_pins Allocate_unit_0/rc1]
connect_bd_net [get_bd_pins Register_File_1/rb2] [get_bd_pins Allocate_unit_0/rb2]
connect_bd_net [get_bd_pins Register_File_1/rb1] [get_bd_pins Allocate_unit_0/rb1]
connect_bd_net [get_bd_pins Register_File_1/ra2] [get_bd_pins Allocate_unit_0/ra2]
connect_bd_net [get_bd_pins Register_File_1/ra1] [get_bd_pins Allocate_unit_0/ra1]
connect_bd_net [get_bd_pins Register_File_1/RDD1_out] [get_bd_pins Register_Interdepend_0/Rd1] [get_bd_pins Allocate_unit_0/Rd1]
connect_bd_net [get_bd_pins Register_File_1/RDD2_out] [get_bd_pins Register_Interdepend_0/Rd2] [get_bd_pins Allocate_unit_0/Rd2]
connect_bd_net [get_bd_pins Reorder_Buffer_0/ROB2] [get_bd_pins Reservation_Station_0/ROB2] [get_bd_pins Register_File_1/ROB2]
connect_bd_net [get_bd_pins Reorder_Buffer_0/ROB1] [get_bd_pins Reservation_Station_0/ROB1] [get_bd_pins Register_File_1/ROB1]
connect_bd_net [get_bd_pins Reorder_Buffer_0/reg_data1] [get_bd_pins Reservation_Station_0/reg_data1] [get_bd_pins Register_File_1/reg_data1]
connect_bd_net [get_bd_pins Reorder_Buffer_0/reg_data2] [get_bd_pins Reservation_Station_0/reg_data2] [get_bd_pins Register_File_1/reg_data2]
connect_bd_net [get_bd_pins Reorder_Buffer_0/RD2] [get_bd_pins Register_File_1/RD2]
connect_bd_net [get_bd_pins Write_back_signals_0/wR1] [get_bd_pins Reservation_Station_0/wb1] [get_bd_pins Register_File_1/wb1]
connect_bd_net [get_bd_pins Write_back_signals_0/wR2] [get_bd_pins Reservation_Station_0/wb2] [get_bd_pins Register_File_1/wb2]
connect_bd_net [get_bd_pins Register_File_1/RA1_t] [get_bd_pins Reorder_Buffer_0/RA1_t]
connect_bd_net [get_bd_pins Register_File_1/RA2_t] [get_bd_pins Reorder_Buffer_0/RA2_t]
connect_bd_net [get_bd_pins Register_File_1/RB1_t] [get_bd_pins Reorder_Buffer_0/RB1_t]
connect_bd_net [get_bd_pins Register_File_1/RB2_t] [get_bd_pins Reorder_Buffer_0/RB2_t]
connect_bd_net [get_bd_pins Register_File_1/Rc1_t] [get_bd_pins Reorder_Buffer_0/RC1_t]
connect_bd_net [get_bd_pins Register_File_1/RC2_t] [get_bd_pins Reorder_Buffer_0/RC2_t]
connect_bd_net [get_bd_pins Reorder_Buffer_0/ROB_ra1] [get_bd_pins Register_File_1/ROB_ra1]
connect_bd_net [get_bd_pins Reorder_Buffer_0/ROB_ra2] [get_bd_pins Register_File_1/ROB_ra2]
connect_bd_net [get_bd_pins Reorder_Buffer_0/ROB_rb1] [get_bd_pins Register_File_1/ROB_rb1]
connect_bd_net [get_bd_pins Reorder_Buffer_0/ROB_rb2] [get_bd_pins Register_File_1/ROB_rb2]
connect_bd_net [get_bd_pins Reorder_Buffer_0/ROB_rc1] [get_bd_pins Register_File_1/ROB_rc1]
connect_bd_net [get_bd_pins Reorder_Buffer_0/ROB_rc2] [get_bd_pins Register_File_1/ROB_rc2]
connect_bd_net [get_bd_pins Reorder_Buffer_0/valid_ROB] [get_bd_pins Register_File_1/valid_ROB]

validate_bd_design
save_bd_design
